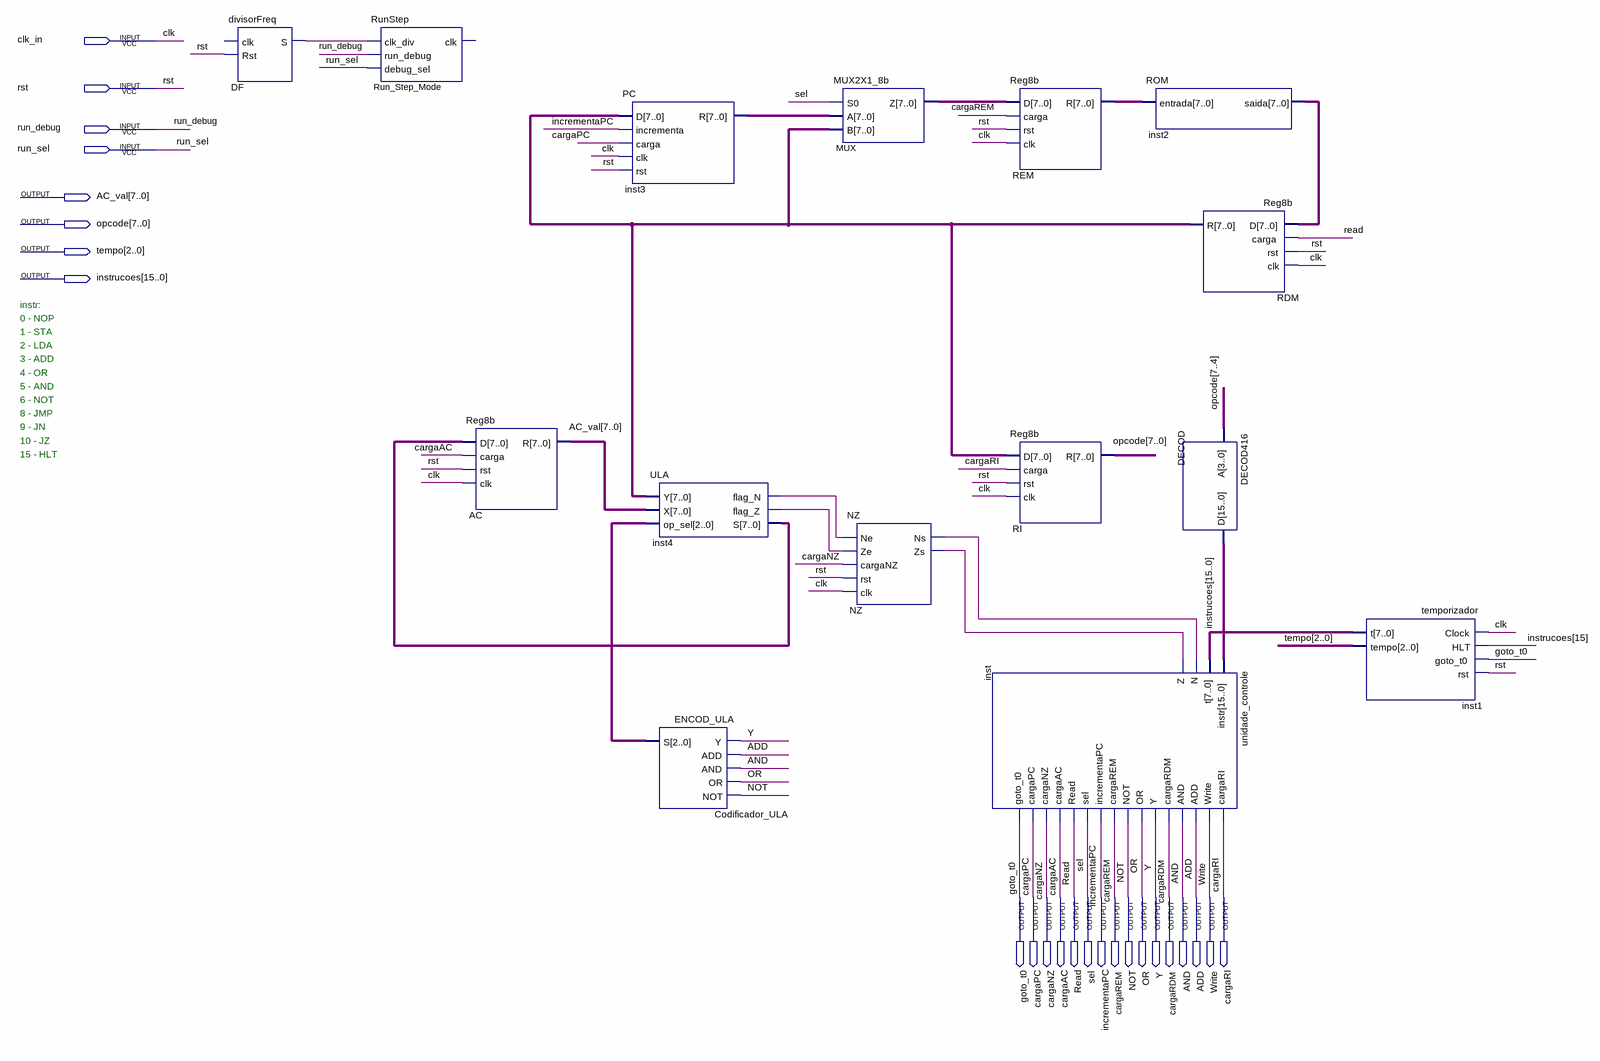
[diagram p0: schematic sheet]
// Quartus schematic Neander.bdf as structural Verilog: 15 symbols, 24 pins
module Neander (
  input  clk_in,
  input  rst,
  input  run_debug,
  input  run_sel,
  output [7:0] AC_val,
  output [7:0] opcode,
  output [2:0] tempo,
  output [15:0] instrucoes,
  output goto_t0,
  output cargaPC,
  output cargaNZ,
  output cargaAC,
  output Read,
  output sel,
  output incrementaPC,
  output cargaREM,
  output NOT,
  output OR,
  output Y,
  output cargaRDM,
  output AND,
  output ADD,
  output Write,
  output cargaRI
);

  wire DF_s, inst4_flag_n, inst4_flag_z, NZ_ns, NZ_zs;
  wire [2:0] Codificador_ULA_s;
  wire [7:0] inst1_t, inst2_saida, inst3_r, inst4_s, MUX_z, RDM_r, REM_r;

  divisorFreq DF (.Rst(rst), .S(DF_s));  // open: clk
  RunStep Run_Step_Mode (.clk_div(DF_s), .run_debug(run_debug), .debug_sel(run_sel));  // open: clk
  Reg8b AC (.D(inst4_s), .carga(cargaAC), .rst(rst), .clk(clk_in), .R(AC_val));
  PC inst3 (.D(RDM_r), .incrementa(incrementaPC), .carga(cargaPC), .clk(clk_in), .rst(rst), .R(inst3_r));
  ULA inst4 (
    .Y(RDM_r), .X(AC_val), .op_sel(Codificador_ULA_s), .flag_N(inst4_flag_n), .flag_Z(inst4_flag_z),
    .S(inst4_s));
  ENCOD_ULA Codificador_ULA (.Y(Y), .ADD(ADD), .AND(AND), .OR(OR), .NOT(NOT), .S(Codificador_ULA_s));
  MUX2X1_8b MUX (.S0(sel), .A(inst3_r), .B(RDM_r), .Z(MUX_z));
  NZ NZ (.Ne(inst4_flag_n), .Ze(inst4_flag_z), .cargaNZ(cargaNZ), .rst(rst), .clk(clk_in), .Ns(NZ_ns), .Zs(NZ_zs));
  Reg8b REM (.D(MUX_z), .carga(cargaREM), .rst(rst), .clk(clk_in), .R(REM_r));
  Reg8b RI (.D(RDM_r), .carga(cargaRI), .rst(rst), .clk(clk_in), .R(opcode));
  unidade_controle inst (
    .instr(instrucoes), .t(inst1_t), .N(NZ_ns), .Z(NZ_zs), .cargaRI(cargaRI), .Write(Write), .ADD(ADD),
    .AND(AND), .cargaRDM(cargaRDM), .Y(Y), .OR(OR), .NOT(NOT), .cargaREM(cargaREM),
    .incrementaPC(incrementaPC), .sel(sel), .Read(Read), .cargaAC(cargaAC), .cargaNZ(cargaNZ),
    .cargaPC(cargaPC), .goto_t0(goto_t0));
  ROM inst2 (.entrada(REM_r), .saida(inst2_saida));
  DECOD416 DECOD (.A(opcode[7:4]), .D(instrucoes));
  Reg8b RDM (.D(inst2_saida), .carga(Read), .rst(rst), .clk(clk_in), .R(RDM_r));
  temporizador inst1 (.Clock(clk_in), .HLT(instrucoes[15]), .goto_t0(goto_t0), .rst(rst), .t(inst1_t), .tempo(tempo));

  // Other names for the same wires on the sheet: clk = clk_in

  // Notes on the sheet:
  //   instr:
  //   0 - NOP
  //   1 - STA
  //   2 - LDA
  //   3 - ADD
  //   4 - OR
  //   5 - AND
  //   6 - NOT
  //   8 - JMP
  //   9 - JN
  //   10 - JZ
  //   15 - HLT
endmodule
